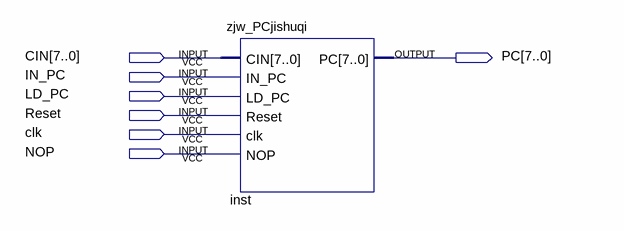
[diagram p0: schematic sheet]
// Quartus schematic Block1.bdf as structural Verilog: 1 symbols, 7 pins
module Block1 (
  input  [7:0] CIN,
  input  IN_PC,
  input  LD_PC,
  input  Reset,
  input  clk,
  input  NOP,
  output [7:0] PC
);

  zjw_PCjishuqi inst (.CIN(CIN), .IN_PC(IN_PC), .LD_PC(LD_PC), .Reset(Reset), .clk(clk), .NOP(NOP), .PC(PC));
endmodule
